# EAGLE design R111+ (EAGLE 4.11)
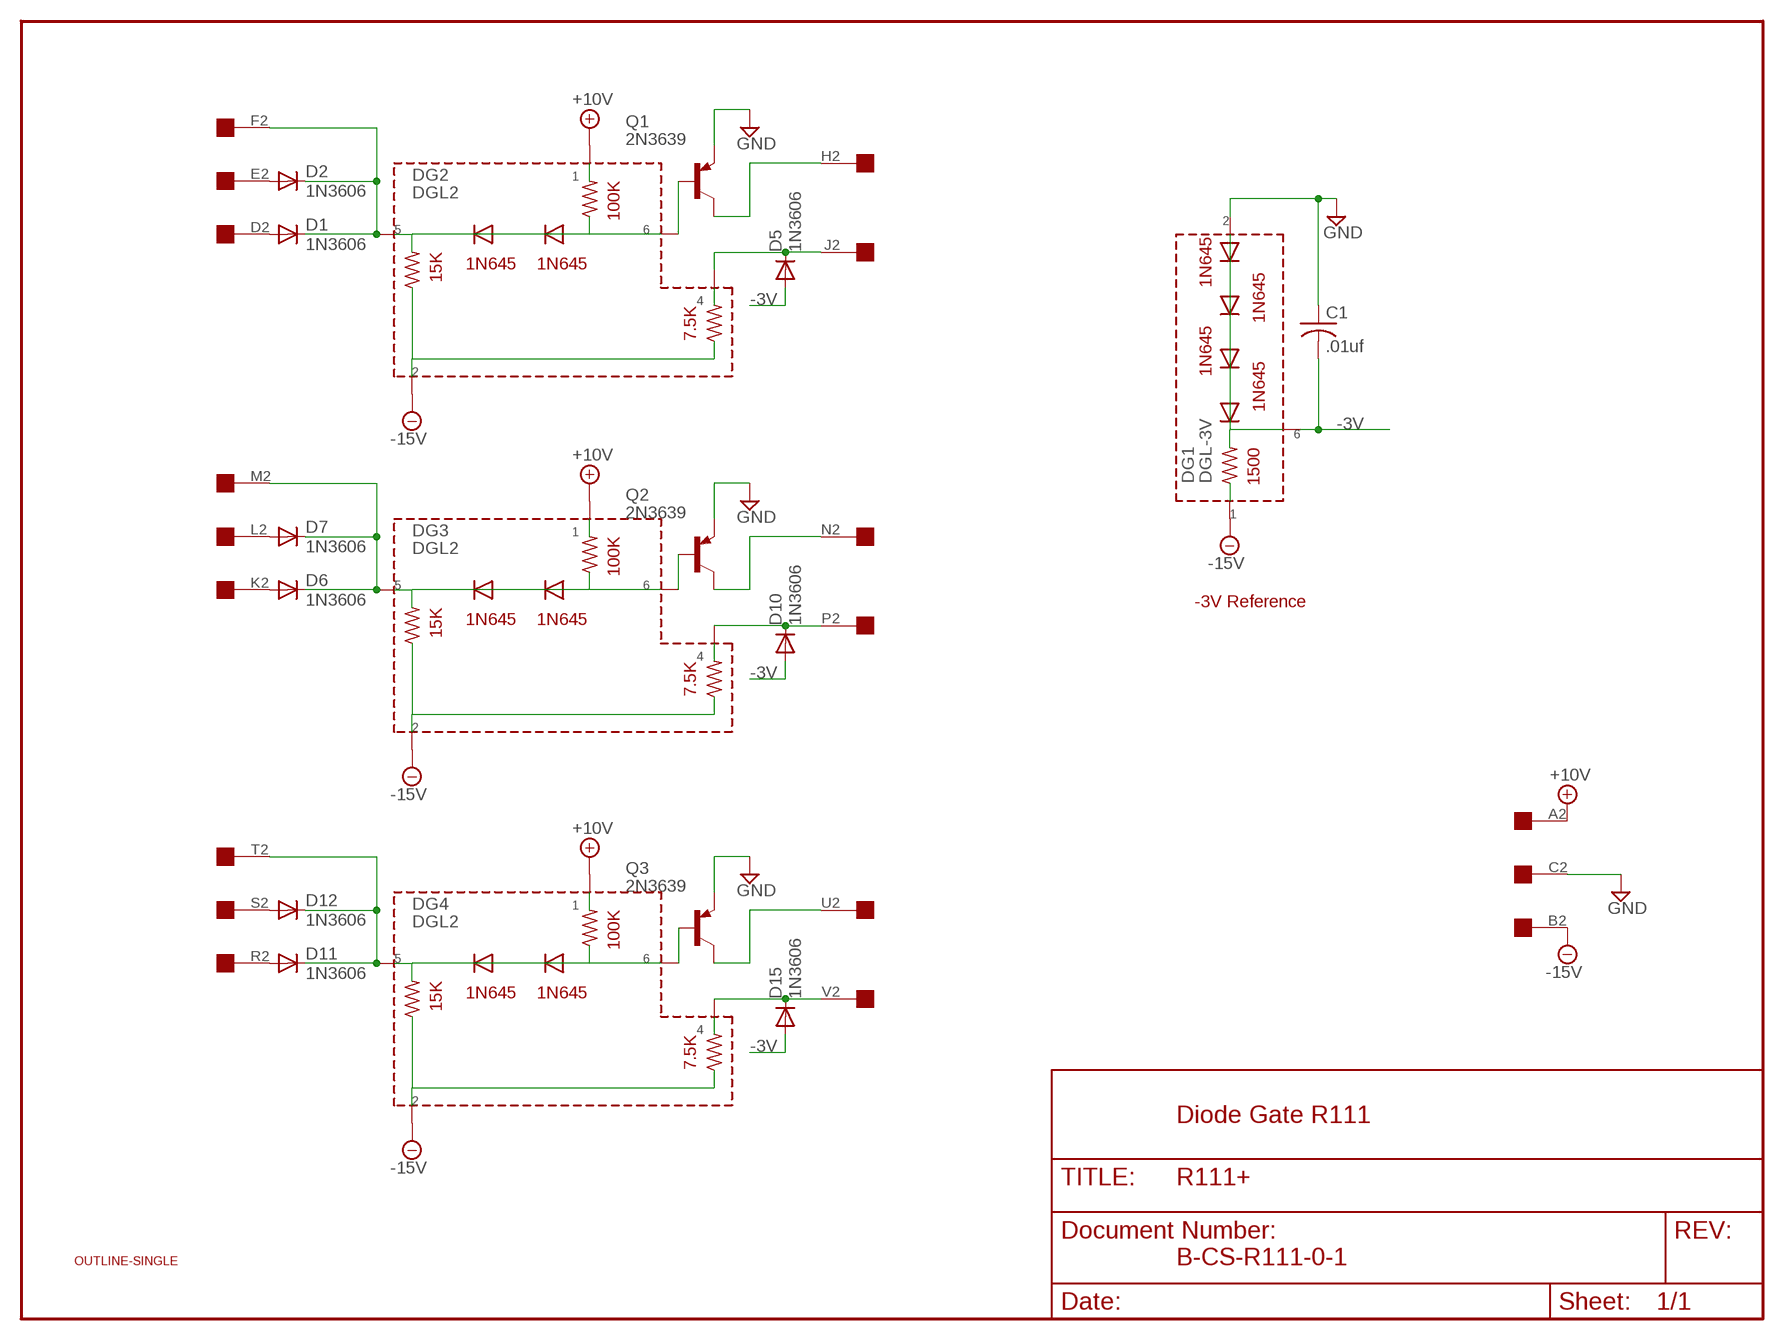
[diagram p0: schematic, sheet 1]

## Parts
C1  .01uf  C-US050-025X075  [C050-025X075]
D1  1N3606  1N4148  [DO35-10]
D2  1N3606  1N4148  [DO35-10]
D5  1N3606  1N4148  [DO35-10]
D6  1N3606  1N4148  [DO35-10]
D7  1N3606  1N4148  [DO35-10]
D10  1N3606  1N4148  [DO35-10]
D11  1N3606  1N4148  [DO35-10]
D12  1N3606  1N4148  [DO35-10]
D15  1N3606  1N4148  [DO35-10]
DG1  DGL-3V  [DGL2]
DG2  DGL2  [DGL2]
DG3  DGL2  [DGL2]
DG4  DGL2  [DGL2]
Q1  2N3639  2N3637  [TO39]
Q2  2N3639  2N3637  [TO39]
Q3  2N3639  2N3637  [TO39]
U$1  OUTLINE-SINGLE  [SINGLE]
U$2  EDGE-1  [EDGE-CON1]

## Nets
+10V [Power]: DG2.P$1 DG3.P$1 DG4.P$1 U$2.A2
-3V [Power]: C1.2 D5.A D10.A D15.A DG1.P$6
-15V [Power]: DG1.P$1 DG2.P$2 DG3.P$2 DG4.P$2 U$2.B2
GND [Power]: C1.1 DG1.P$2 Q1.1(E) Q2.1(E) Q3.1(E) U$2.C2
N$1: D6.A U$2.K2
N$2: DG2.P$6 Q1.2(B)
N$4: D10.C DG3.P$4 U$2.P2
N$5: Q1.3(C) U$2.H2
N$6: D6.C D7.C DG3.P$5 U$2.M2
N$7: DG3.P$6 Q2.2(B)
N$8: DG4.P$6 Q3.2(B)
N$9: D15.C DG4.P$4 U$2.V2
N$10: D11.A U$2.R2
N$11: D11.C D12.C DG4.P$5 U$2.T2
N$14: D7.A U$2.L2
N$15: Q2.3(C) U$2.N2
N$17: Q3.3(C) U$2.U2
N$20: D5.C DG2.P$4 U$2.J2
N$21: D1.A U$2.D2
N$22: D1.C D2.C DG2.P$5 U$2.F2
N$31: D12.A U$2.S2
N$39: D2.A U$2.E2

## Notes on the sheet
- -3V Reference
- Diode Gate R111
- B-CS-R111-0-1

## Library data of the parts
C1 = rcl:C-US: CAPACITOR, American symbol
D1 D2 D5-D7 D10-D12 D15 = diode:1N4148: DIODE high speed (Philips)
DG1 = dec-con:DGL-3V: -3V Clamp/Reference
DG2-DG4 = dec-con:DGL2: Diode Gate Logic Block
Q1-Q3 = transistor-pnp:2N3637*: PNP Transistror
U$1 = dec-con:OUTLINE-*: Board outlines for DEC boards.
U$2 = dec-con:EDGE-1: Single-Sided DEC Edge Connector -- (side 2)

## Net classes
1 Power: width 0.813 mm

## Board
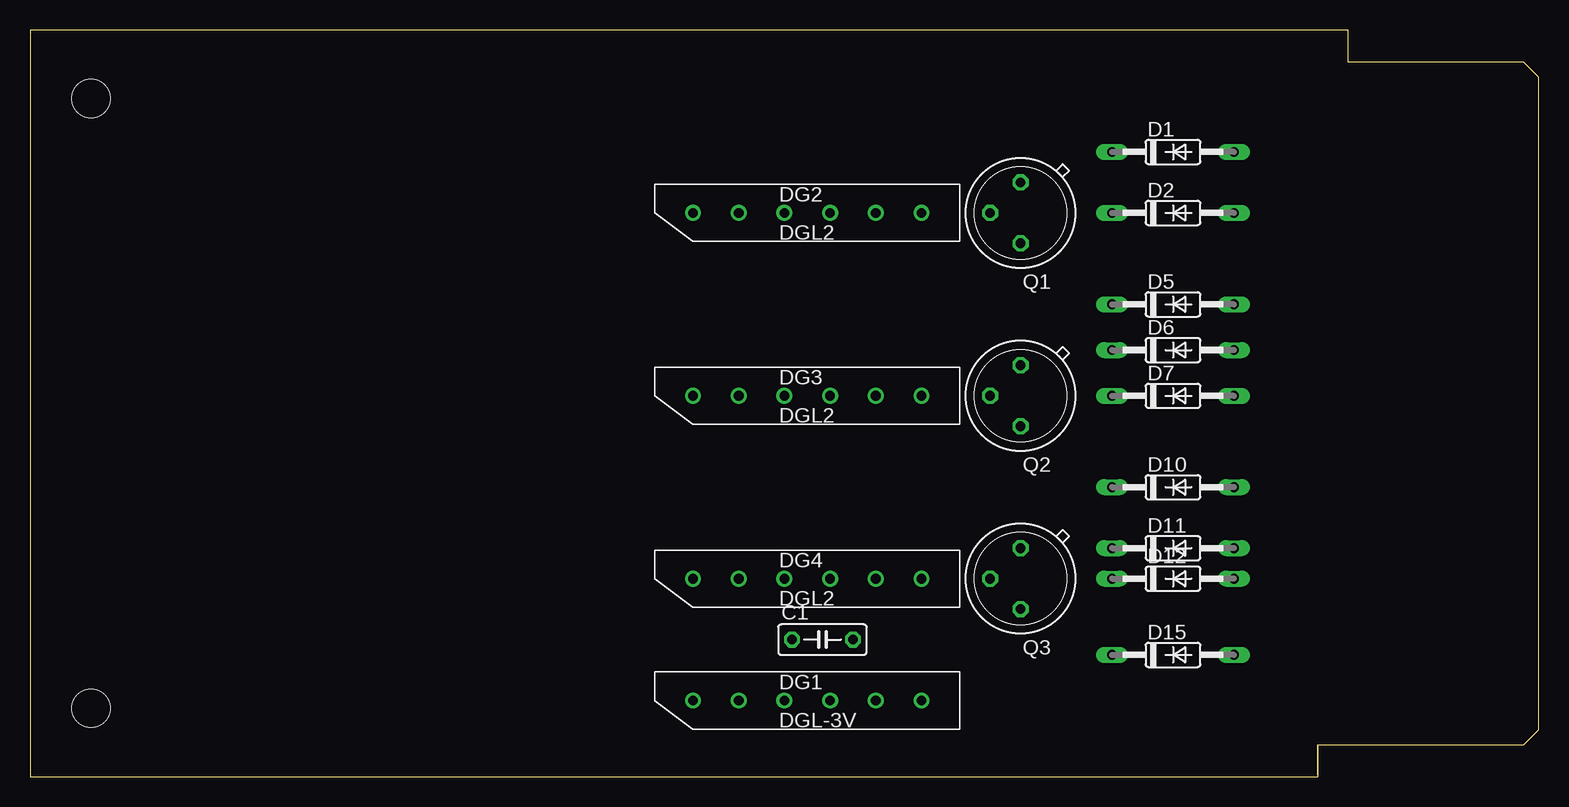
[diagram p1: board, top side]
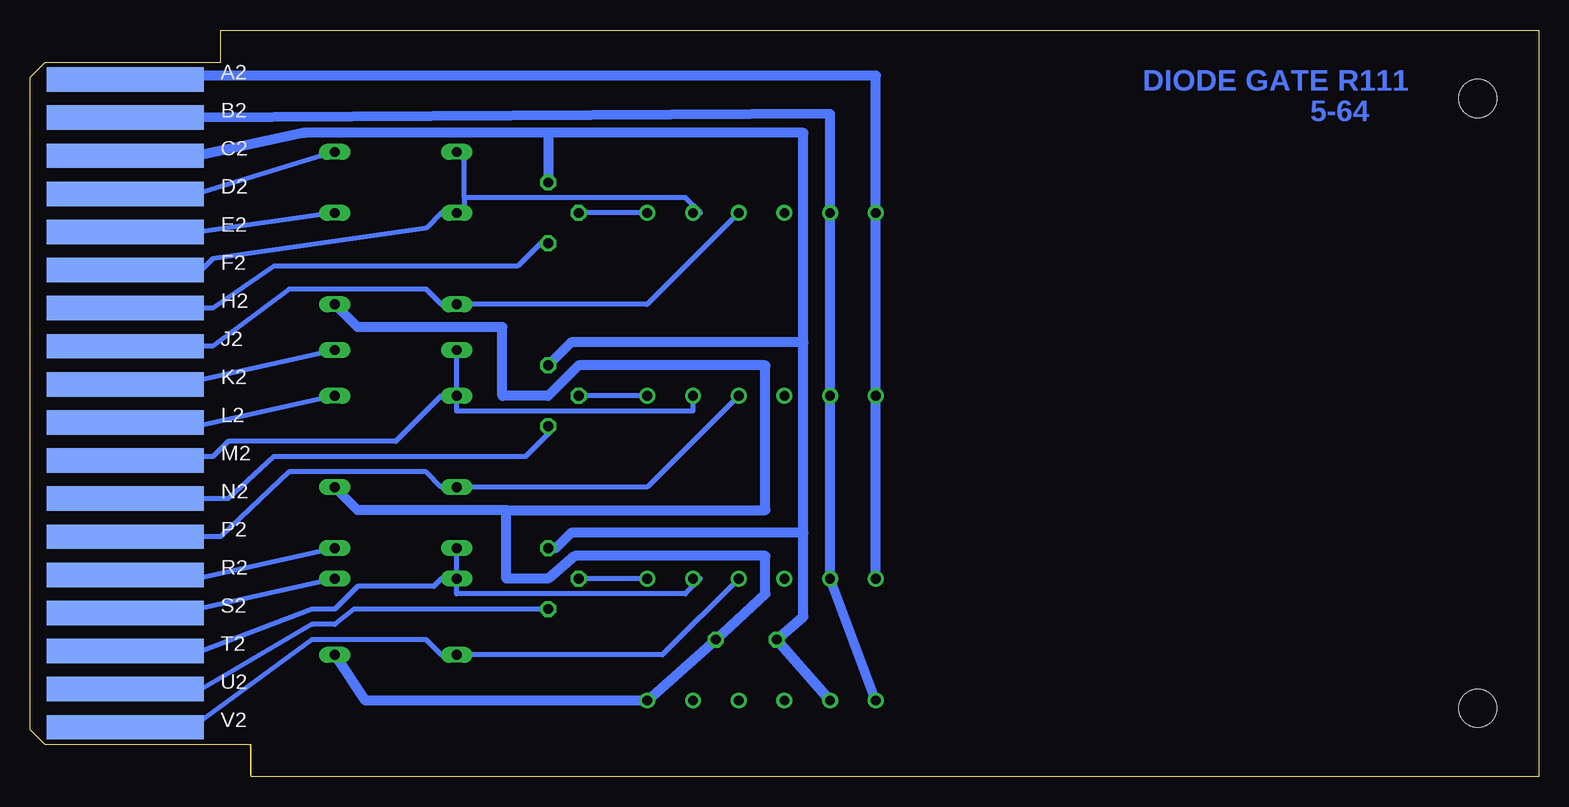
[diagram p2: board, bottom side, seen from below]

Size 125.73 x 62.23 mm. Coordinates in mm from the lower left corner, seen from the top.
Copper layers (1+16): Top 0.035mm / dielectric 1.5mm / Bottom 0.035mm
Design rules "16mils": minimum track width 16mil, minimum drill 32mil, track to track 15mil, track to pad 10mil, pad to pad 10mil, via to via 10mil, smd to smd 10mil, copper to edge 13mil, drill to drill 10mil, minimum pad ring 10mil, minimum via ring 8mil, stop-mask expansion 0mil, vias tented up to drill 0mil, thermal gap 10mil

### Footprints (pad centres in the part's own frame; a part is rotated, then mirrored left to right if it is on the bottom)
C050-025X075 = drill 0.813 octagon: 1 -2.54,0; 2 2.54,0
DO35-10 = drill 0.813 long: A 5.08,0; C -5.08,0
DGL2 = drill 0.813: P$1 -9.525,0; P$2 -5.715,0; P$3 -1.905,0; P$4 1.905,0; P$5 5.715,0; P$6 9.525,0
TO39 = drill 0.813 octagon: 1 0,-2.54; 2 2.54,0; 3 0,2.54
SINGLE = hole 3.175: 120.65,56.515; 120.65,5.715
EDGE-CON1 = smd 13.106 x 2.032 bottom: A2 7.938,4.128; B2 7.938,7.303; C2 7.938,10.477; D2 7.938,13.652; E2 7.938,16.828; F2 7.938,20.003; H2 7.938,23.177; J2 7.938,26.352; K2 7.938,29.527; L2 7.938,32.703; M2 7.938,35.877; N2 7.938,39.053; P2 7.938,42.227; R2 7.938,45.403; S2 7.938,48.578; T2 7.938,51.752; U2 7.938,54.928; V2 7.938,58.102

### Placement (x,y rotation side)
C1  66.04,11.43 0 top
D1  95.25,52.07 0 top
D2  95.25,46.99 0 top
D5  95.25,39.37 0 top
D6  95.25,35.56 0 top
D7  95.25,31.75 0 top
D10  95.25,24.13 0 top
D11  95.25,19.05 0 top
D12  95.25,16.51 0 top
D15  95.25,10.16 0 top
DG1  64.77,6.35 0 top
DG2  64.77,46.99 0 top
DG3  64.77,31.75 0 top
DG4  64.77,16.51 0 top
Q1  82.55,46.99 180 top
Q2  82.55,31.75 180 top
Q3  82.55,16.51 180 top
U$1  125.73,62.23 180 top
U$2  125.73,62.23 180 top

### Tracks (layer width: path | path; a pad name or v marks a point on that pad's centre or on a via)
+10V
  Bottom 0.813: U$2.A2 111.76,58.42 55.25,58.42 DG2.P$1 DG3.P$1 DG4.P$1
-3V
  Bottom 0.813: D15.A 97.79,6.35 DG1.P$6 C1.2 64.45,15.24 64.45,18.41 80.33,18.41 82.55,16.51 86.04,16.51 86.04,22.22 | D10.A 98.42,22.22 86.36,22.22 86.04,22.22 | 86.04,22.22 64.45,22.22 64.45,34.29 80.01,34.29 82.55,31.75 86.36,31.75 86.36,37.46 98.42,37.46 D5.A
-15V
  Bottom 0.813: U$2.B2 112.08,54.93 59.06,55.24 DG2.P$2 DG3.P$2 DG4.P$2 DG1.P$1
GND
  Bottom 0.813: 82.55,53.66 61.28,53.66 61.28,36.2 | 82.55,53.66 102.87,53.66 111.76,51.75 U$2.C2 | Q2.1 80.65,36.2 61.28,36.2 | 61.28,20.32 61.28,36.2 | 61.28,20.32 80.65,20.32 81.92,19.05 Q3.1 | 61.28,20.32 61.28,13.33 C1.1 DG1.P$2 | 82.55,53.66 Q1.1
N$1
  Bottom 0.406: D6.A 111.76,33.02 U$2.K2
N$2
  Bottom 0.406: DG2.P$6 Q1.2
N$4
  Bottom 0.406: U$2.P2 109.86,20 104.14,25.4 92.71,25.4 91.44,24.13 D10.C 74.3,24.13 DG3.P$4
N$5
  Bottom 0.406: Q1.3 83.19,44.45 85.09,42.54 105.41,42.54 110.49,39.05 U$2.H2
N$6
  Bottom 0.406: D7.C 90.17,30.48 70.48,30.48 DG3.P$5 | D7.C D6.C | U$2.M2 111.76,26.67 110.49,26.67 109.22,27.94 95.25,27.94 91.44,31.75 D7.C
N$7
  Bottom 0.406: DG3.P$6 Q2.2
N$8
  Bottom 0.406: DG4.P$6 Q3.2
N$9
  Bottom 0.406: U$2.V2 111.76,4.44 102.23,11.43 92.71,11.43 91.44,10.16 D15.C 73.03,10.16 DG4.P$4
N$10
  Bottom 0.406: D11.A 111.76,16.51 U$2.R2
N$11
  Bottom 0.406: D12.C 90.17,15.24 71.12,15.24 69.85,16.51 DG4.P$5 | D12.C D11.C | D12.C 91.44,16.51 92.08,15.87 98.42,15.87 100.33,13.97 102.23,13.97 111.44,10.48 U$2.T2
N$14
  Bottom 0.406: D7.A 111.76,29.21 U$2.L2
N$15
  Bottom 0.406: U$2.N2 111.76,23.18 109.22,23.18 105.41,26.67 84.45,26.67 82.55,28.57 Q2.3
N$17
  Bottom 0.406: Q3.3 98.74,13.97 100.33,12.7 102.23,12.7 111.44,7.3 112.08,7.3 U$2.U2
N$20
  Bottom 0.406: U$2.J2 110.49,35.88 104.14,40.64 92.71,40.64 91.44,39.37 D5.C 74.3,39.37 DG2.P$4
N$21
  Bottom 0.406: D1.A 111.76,48.58 U$2.D2
N$22
  Bottom 0.406: 89.54,48.26 89.54,47.62 D2.C 91.44,46.99 92.71,45.72 110.49,43.18 111.76,41.91 U$2.F2 | 89.54,48.26 89.54,51.43 D1.C | 89.54,48.26 71.12,48.26 69.85,46.99 DG2.P$5
N$31
  Bottom 0.406: D12.A 111.76,13.97 U$2.S2
N$39
  Bottom 0.406: D2.A 111.44,45.4 U$2.E2

### Text on the board
Bottom: DIODE GATE R111 | 5-64